# Altium schematic sheet ESC.SchDoc
size A4
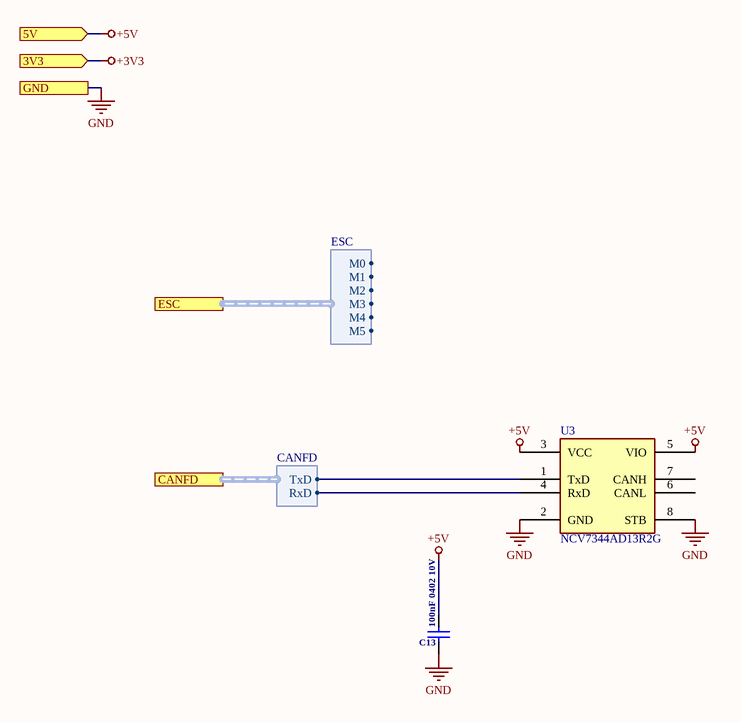
[diagram p0: ESC.SchDoc]

## Parts
C13  100nF 0402 10V
U3  NCV7344AD13R2G  [SOIC127P600X175-8N]

## Ports
3V3 (in), 5V (in), CANFD (harness CANFD), ESC (harness ESC), GND

## Harnesses
ESC: M0, M1, M2, M3, M4, M5
CANFD: TxD, RxD

## Nets
+3V3: port 3V3
+5V: C13.2 U3.3(VCC) U3.5(VIO) ; port 5V
GND: C13.1 U3.2(GND) U3.8(STB) ; port GND
NetU3_1: U3.1(TxD) ; port CANFD.TxD
NetU3_4: U3.4(RxD) ; port CANFD.RxD

Not connected (* = marked no-connect by the designer): U3 6(CANL) 7(CANH)

## Library data of the parts
C13 = CL05A104KP5NNNC 100nF 0402 10V: Cap Ceramic 0.1uF 10V X5R 10% SMD 0402 85C Paper T/R; Manufacturer: Samsung; Capacitance: 100000 pF; Supplier 1: Digi-Key; Manufacturer Part Number: CL05A104KP5NNNC; Stock 1: 5595689; Pricing 1: 1=0.1, 10=0.021, 50=0.0116, 100=0.0094, 500=0.0067, 1000=0.0053, 2500=0.0048, 5000=0.0044 (USD); Case Size/Dimension: 0402; Dielectric: X5R; Tolerance (%): ±10 %; Rated Voltage: 10 V; ComponentLink1URL: https://www.distrelec.biz/Web/Downloads/_e/ng/MLCC_CatalogDownload2013_ENG.pdf?mime=application%2Fpdf&src-supplier=Distrelec; ComponentLink1Description: https://www.distrelec.biz/Web/Downloads/_e/ng/MLCC_CatalogDownload2013_ENG.pdf?mime=application%2Fpdf&src-supplier=Distrelec; ComponentLink2URL: https://media.digikey.com/pdf/Data%20Sheets/Samsung%20PDFs/CL_Series_MLCC_ds.pdf?src-supplier=Digi-Key; ComponentLink2Description: https://media.digikey.com/pdf/Data%20Sheets/Samsung%20PDFs/CL_Series_MLCC_ds.pdf?src-supplier=Digi-Key; ComponentLink3URL: http://www1.futureelectronics.com/doc/SAMSUNG%20PASSIVE/CL05B104KQ5NNNC.pdf?src-supplier=Future+Electronics; ComponentLink3Description: http://www1.futureelectronics.com/doc/SAMSUNG%20PASSIVE/CL05B104KQ5NNNC.pdf?src-supplier=Future+Electronics; ComponentLink4URL: https://www.verical.com/server-webapp/html/getDatasheet?partID=358611&src-supplier=Verical; ComponentLink4Description: https://www.verical.com/server-webapp/html/getDatasheet?partID=358611&src-supplier=Verical; Supplier Part Number 1: 1276-1022-1-ND; Value: 100nF 0402 10V
U3 = NCV7344AD13R2G: IC TRANSCEIVER HALF 1/1 8SOIC; Supplier 1: Digi-Key; Supplier Part Number 1: 488-NCV7344AD13R2GCT-ND